# EasyEDA schematic Verification_system_schematics.json
TITLE: Sheet_1; REV: 1.0; Date: 2024-05-09; Sheet: 1/1; Drawn By: martin.tab24; Company: Your Company
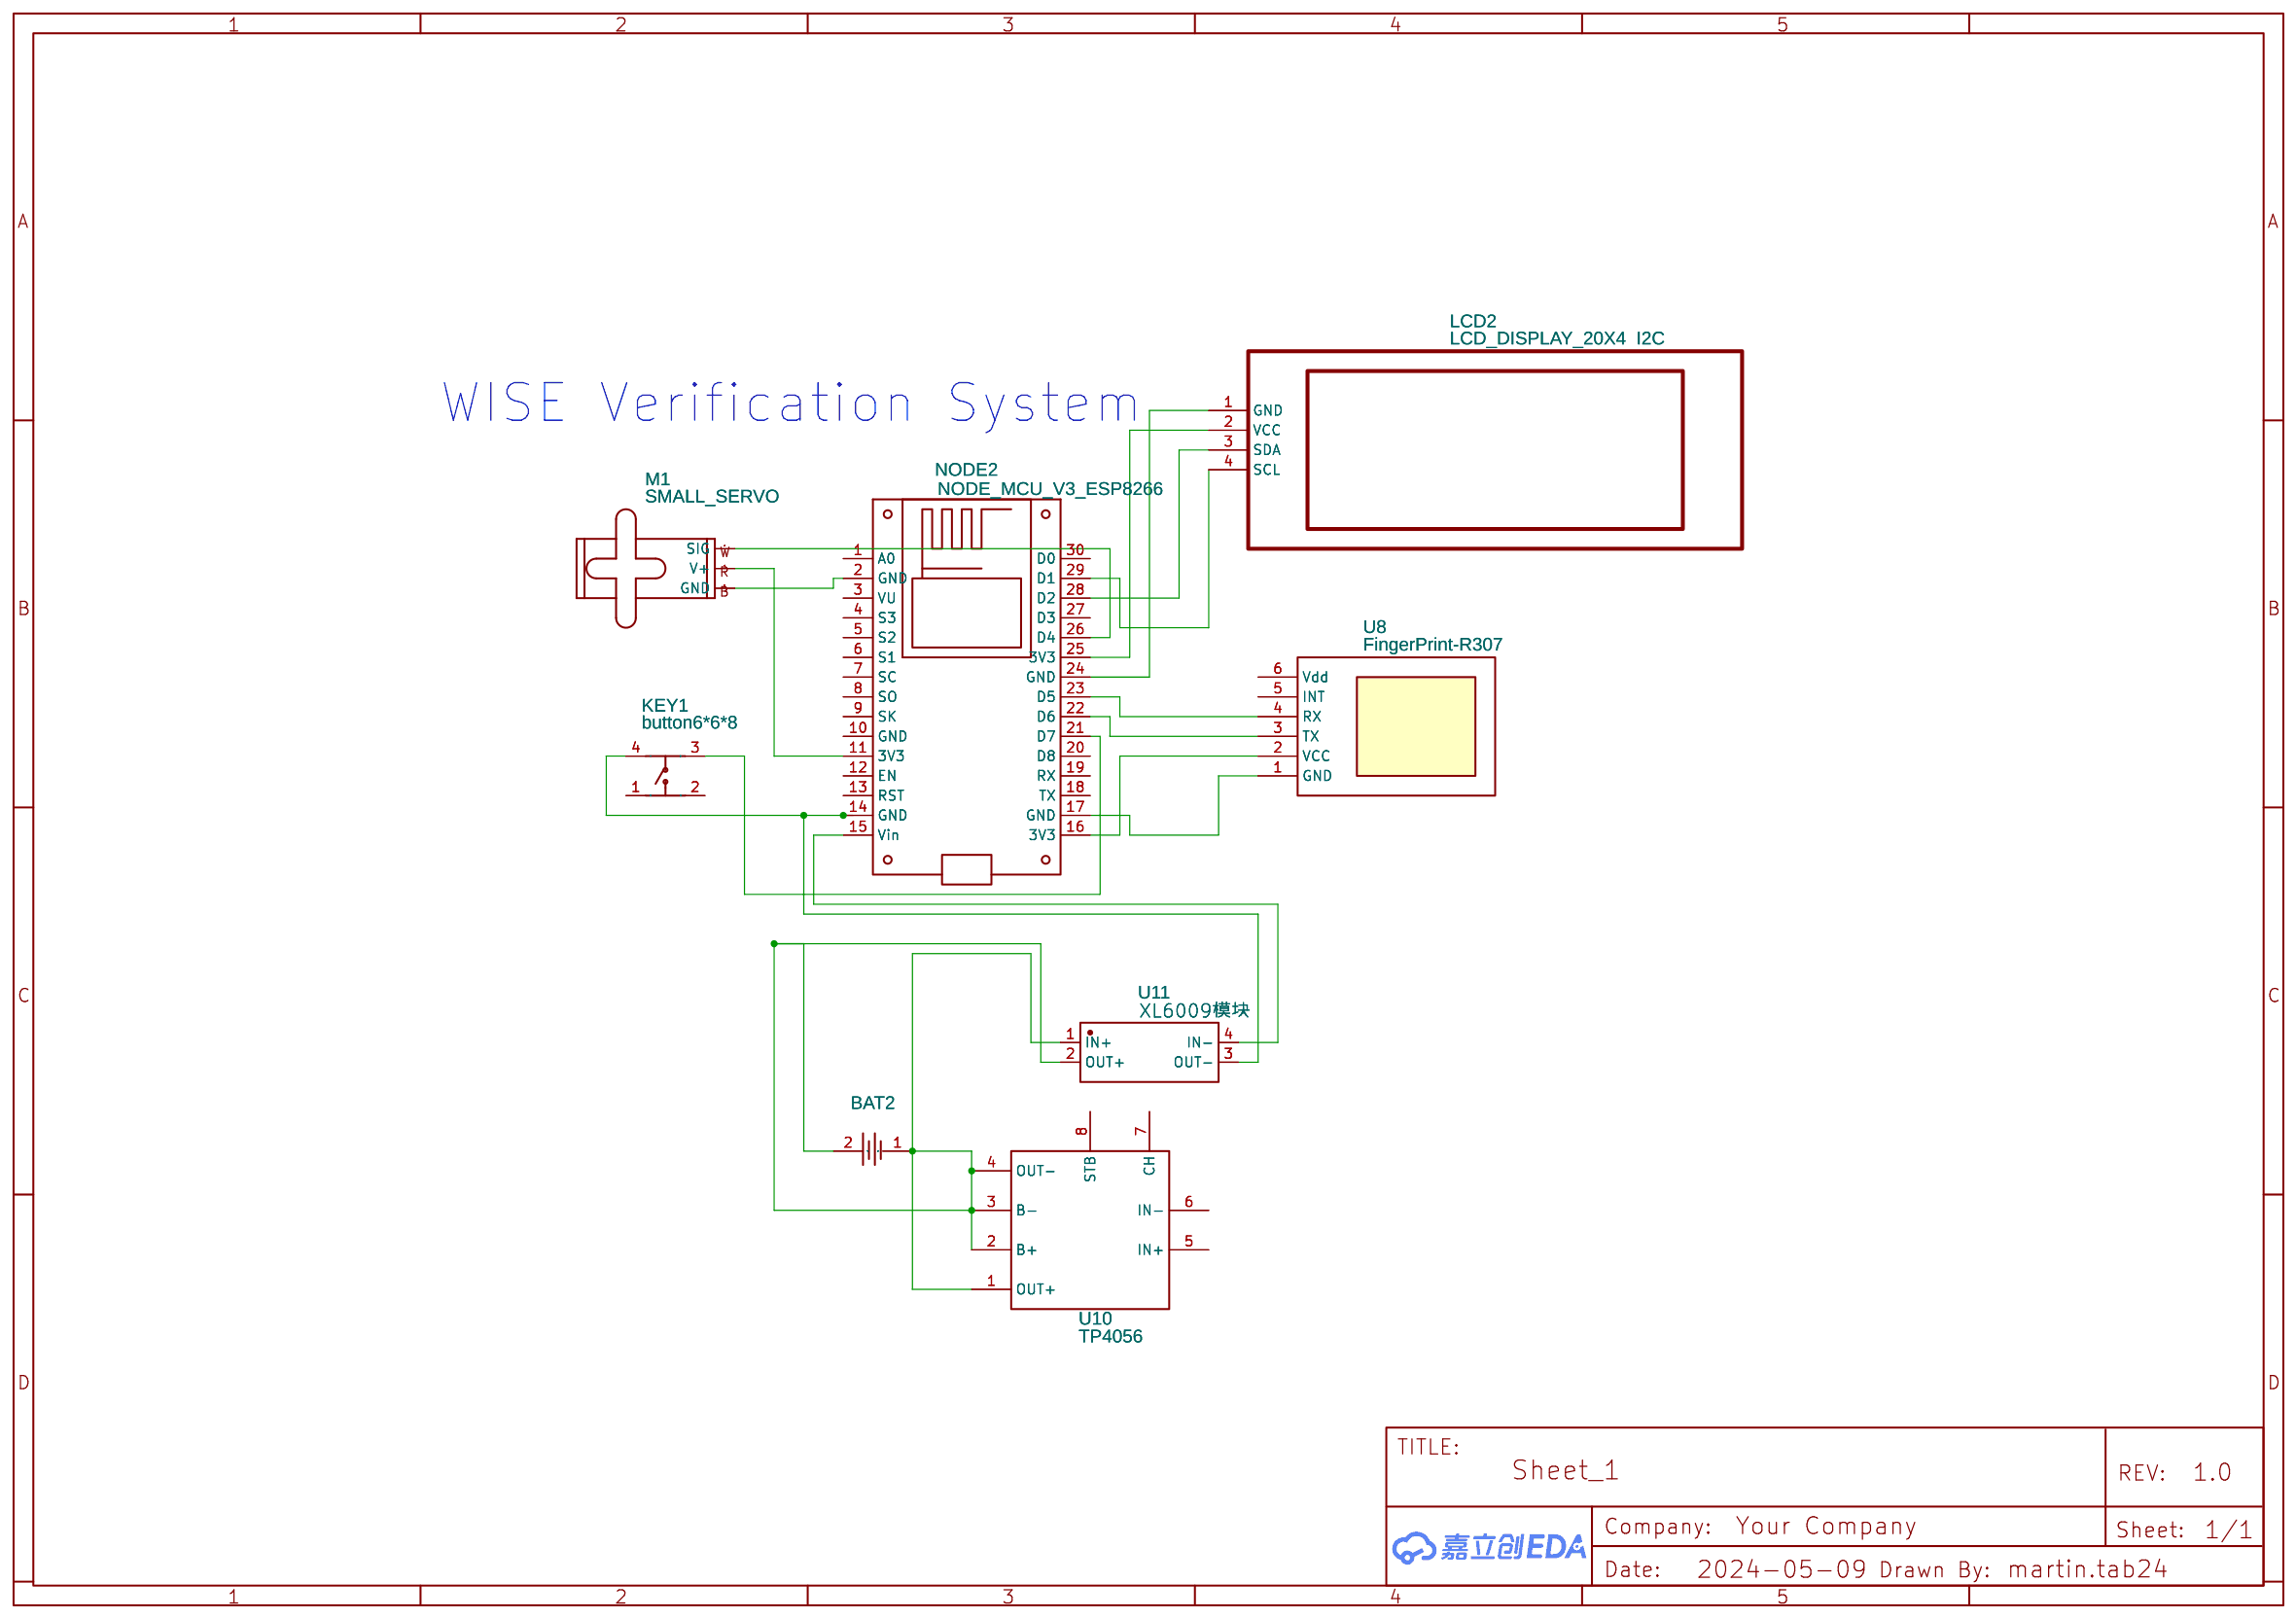
[diagram p0: schematic sheet]

## Parts
BAT2  BH-18650-B6AA002  [BATTERY-SMD_18650-1S-L77.1-W20.7-1]
KEY1  button6*6*8  [KEY-TH_4P-L6.0-W6.0-P4.50-LS7.5]
LCD2  LCD_DISPLAY_20X4  I2C  [LCD_2004_4-8BIT_IF LCD_2004_4-8BIT_IF V4 I2C]
M1  SMALL_SERVO  [1X03]
NODE2  NODE_MCU_V3_ESP8266  [NODEMCU-12E;NODEMCU-ESP8266]
U8  FingerPrint-R307  [SIL-6]
U10  TP4056  [TP4056PCB]
U11  XL6009模块  [XFMR-SMD_XL6009]

## Library data of the parts
BAT2 = BH-18650-B6AA002: Supplier: LCSC; Supplier Part: C7525438; Manufacturer: MYOUNG(美阳); JLCPCB Part Class: Extended Part; Contributor: lcsc
KEY1 = button6*6*8: Supplier Part: C59982; Supplier: LCSC; Manufacturer: ReliaPro; JLCPCB Part Class: Extended Part
LCD2 = LCD_DISPLAY_20X4  I2C: sourceId: yDLFXRL3l; 15: A; Contributor: Adrianus Purba
M1 = SMALL_SERVO: Small servo motor; Contributor: SparkFun
NODE2 = NODE_MCU_V3_ESP8266: Contributor: 1931120074; Supplier: TME
U8 = FingerPrint-R307: Contributor: chrislian; subpart_no: 1
U10 = TP4056: Manufacturer Part: New SchematicLib; Contributor: kors20
U11 = XL6009模块: Contributor: LCSC; Supplier: LCSC; Supplier Part: C2908146; Manufacturer: null; JLCPCB Part Class: Extended Part

## Nets
Net-(BAT2-1): BAT2.1 BAT2.2 U10.1(OUT+) U10.2(B+) U10.3(B-) U10.4(OUT-) U11.1(IN+) U11.2(OUT+)
Net-(KEY1-3): KEY1.3 NODE2.21(D7)
Net-(KEY1-4): KEY1.4 NODE2.14(GND) U11.3(OUT-)
Net-(LCD2-1): LCD2.1(GND) NODE2.24(GND)
Net-(LCD2-2): LCD2.2(VCC) NODE2.25(3V3)
Net-(LCD2-3): LCD2.3(SDA) NODE2.28(D2)
Net-(LCD2-4): LCD2.4(SCL) NODE2.29(D1)
Net-(M1-1): M1.1(SIG) NODE2.26(D4)
Net-(M1-2): M1.2(V+) NODE2.11(3V3)
Net-(M1-3): M1.3(GND) NODE2.2(GND)
Net-(NODE2-15): NODE2.15(Vin) U11.4(IN-)
Net-(NODE2-16): NODE2.16(3V3) U8.2(VCC)
Net-(NODE2-17): NODE2.17(GND) U8.1(GND)
Net-(NODE2-22): NODE2.22(D6) U8.3(TX)
Net-(NODE2-23): NODE2.23(D5) U8.4(RX)

Not connected (* = marked no-connect by the designer): KEY1 1 2; NODE2 1(A0) 3(VU) 4(S3) 5(S2) 6(S1) 7(SC) 8(SO) 9(SK) 10(GND) 12(EN) 13(RST) 18(TX) 19(RX) 20(D8) 27(D3) 30(D0); U8 5(INT) 6(Vdd); U10 5(IN+) 6(IN-) 7(CH) 8(STB)

## Notes on the sheet
- WISE Verification System
